# Altium schematic sheet current_switch.SchDoc: Gemini++
size Letter; Author: Ye-Sheng Kuo; Revision: 7; SheetTotal: 4
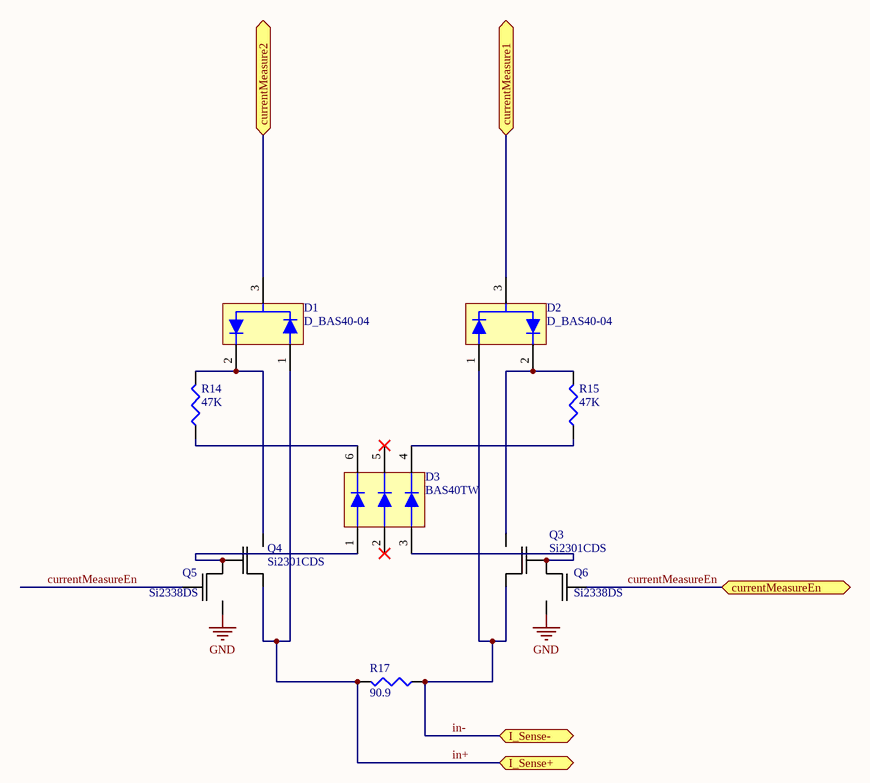
[diagram p0: current_switch.SchDoc]

## Parts
D1  D_BAS40-04  [SOT23-3]
D2  D_BAS40-04  [SOT23-3]
D3  BAS40TW  [SOT-363]
Q3  Si2301CDS  [SOT23-3]
Q4  Si2301CDS  [SOT23-3]
Q5  Si2338DS  [SOT23-3]
Q6  Si2338DS  [SOT23-3]
R14  value 47K  [0402]  (hidden comment: Chip resistor)
R15  value 47K  [0402]  (hidden comment: Chip resistor)
R17  value 90.9  [0603]  (hidden comment: Chip resistor)

## Ports
currentMeasure1, currentMeasure2, currentMeasureEn, I_Sense+, I_Sense-

## Nets
GND: Q5.2(S) Q6.2(S)
currentMeasure1: D2.3 ; port currentMeasure1
currentMeasure2: D1.3 ; port currentMeasure2
currentMeasureEn: Q5.1(G) Q6.1(G) ; port currentMeasureEn
in+: D1.1 Q4.3(D) R17.1 ; port I_Sense+
in-: D2.1 Q3.3(D) R17.2 ; port I_Sense-
NetD1_2: D1.2 Q4.2(S) R14.1
NetD2_2: D2.2 Q3.2(S) R15.1
NetD3_1: D3.1 Q4.1(G) Q5.3(D)
NetD3_3: D3.3 Q3.1(G) Q6.3(D)
NetD3_4: D3.4 R15.2
NetD3_6: D3.6 R14.2

Not connected (* = marked no-connect by the designer): D3 2* 5*

## Notes on the sheet
- Title
- Date:
- Author:
- Revision:
- Sheet
- of
- University of Michigan
- File:

## Library data of the parts
D1 D2 = D_BAS40-04: SURFACE MOUNT SCHOTTKY BARRIER DIODE; Supplier 1: Digi-Key; Supplier Part Number 1: BAS40-04FDICT-ND
D3 = D_BAS40TW: SURFACE MOUNT SCHOTTKY BARRIER DIODE ARRAYS; Supplier 1: Digi-Key; Supplier Part Number 1: BAS40TWDICT-ND
Q3 Q4 = Si2301CDS: P-Channel 20 V (D-S) MOSFET; Supplier 1: Digi-Key; Supplier Part Number 1: SI2301CDS-T1-E3CT-ND
Q5 Q6 = Si2338DS: N-Channel 30 V (D-S) MOSFET; Supplier 1: Digi-Key; Supplier Part Number 1: SI2338DS-T1-GE3CT-ND
R14 R15 = R_47K_0402: Chip resistor, 47K, 0402 package; tolerance: 1%; power: 1/16 W; package: 0402; Supplier 1: Digi-Key; Supplier Part Number 1: 541-47.0KLCT-ND
R17 = R_90.9_0603: Chip resistor, 90.9, 0603 package; tolerance: 0.1%; power: 1/10 W; package: 0603; Supplier 1: Digi-Key; Supplier Part Number 1: P90.9DBCT-ND